# EAGLE design power_bus_v1 (EAGLE 9.6.2)
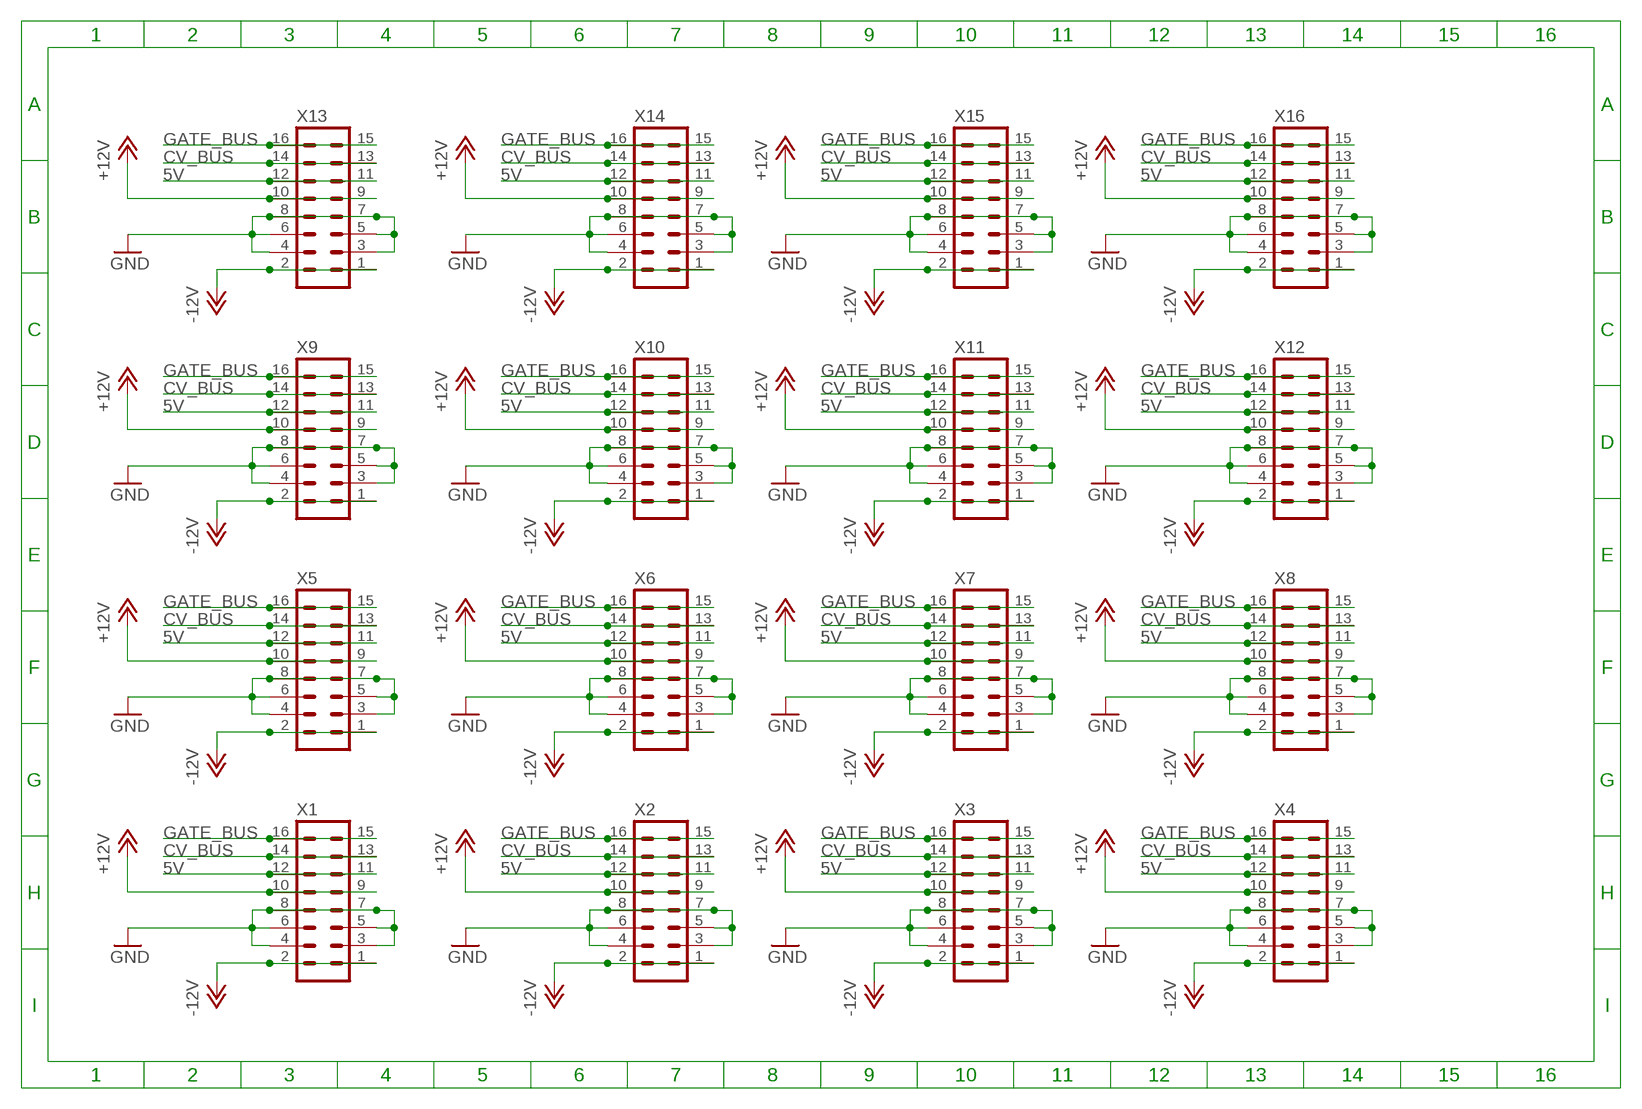
[diagram p0: schematic, sheet 1]

## Parts
X1  ML16  [ML16]
X2  ML16  [ML16]
X3  ML16  [ML16]
X4  ML16  [ML16]
X5  ML16  [ML16]
X6  ML16  [ML16]
X7  ML16  [ML16]
X8  ML16  [ML16]
X9  ML16  [ML16]
X10  ML16  [ML16]
X11  ML16  [ML16]
X12  ML16  [ML16]
X13  ML16  [ML16]
X14  ML16  [ML16]
X15  ML16  [ML16]
X16  ML16  [ML16]

## Nets
5V [power]: X1.11 X1.12 X2.11 X2.12 X3.11 X3.12 X4.11 X4.12 X5.11 X5.12 X6.11 X6.12 X7.11 X7.12 X8.11 X8.12 X9.11 X9.12 X10.11 X10.12 X11.11 X11.12 X12.11 X12.12 X13.11 X13.12 X14.11 X14.12 X15.11 X15.12 X16.11 X16.12
+12V [power]: X1.9 X1.10 X2.9 X2.10 X3.9 X3.10 X4.9 X4.10 X5.9 X5.10 X6.9 X6.10 X7.9 X7.10 X8.9 X8.10 X9.9 X9.10 X10.9 X10.10 X11.9 X11.10 X12.9 X12.10 X13.9 X13.10 X14.9 X14.10 X15.9 X15.10 X16.9 X16.10
-12V [power]: X1.1 X1.2 X2.1 X2.2 X3.1 X3.2 X4.1 X4.2 X5.1 X5.2 X6.1 X6.2 X7.1 X7.2 X8.1 X8.2 X9.1 X9.2 X10.1 X10.2 X11.1 X11.2 X12.1 X12.2 X13.1 X13.2 X14.1 X14.2 X15.1 X15.2 X16.1 X16.2
CV_BUS [power]: X1.13 X1.14 X2.13 X2.14 X3.13 X3.14 X4.13 X4.14 X5.13 X5.14 X6.13 X6.14 X7.13 X7.14 X8.13 X8.14 X9.13 X9.14 X10.13 X10.14 X11.13 X11.14 X12.13 X12.14 X13.13 X13.14 X14.13 X14.14 X15.13 X15.14 X16.13 X16.14
GATE_BUS [power]: X1.15 X1.16 X2.15 X2.16 X3.15 X3.16 X4.15 X4.16 X5.15 X5.16 X6.15 X6.16 X7.15 X7.16 X8.15 X8.16 X9.15 X9.16 X10.15 X10.16 X11.15 X11.16 X12.15 X12.16 X13.15 X13.16 X14.15 X14.16 X15.15 X15.16 X16.15 X16.16
GND [power]: X1.3 X1.4 X1.5 X1.6 X1.7 X1.8 X2.3 X2.4 X2.5 X2.6 X2.7 X2.8 X3.3 X3.4 X3.5 X3.6 X3.7 X3.8 X4.3 X4.4 X4.5 X4.6 X4.7 X4.8 X5.3 X5.4 X5.5 X5.6 X5.7 X5.8 X6.3 X6.4 X6.5 X6.6 X6.7 X6.8 X7.3 X7.4 X7.5 X7.6 X7.7 X7.8 X8.3 X8.4 X8.5 X8.6 X8.7 X8.8 X9.3 X9.4 X9.5 X9.6 X9.7 X9.8 X10.3 X10.4 X10.5 X10.6 X10.7 X10.8 X11.3 X11.4 X11.5 X11.6 X11.7 X11.8 X12.3 X12.4 X12.5 X12.6 X12.7 X12.8 X13.3 X13.4 X13.5 X13.6 X13.7 X13.8 X14.3 X14.4 X14.5 X14.6 X14.7 X14.8 X15.3 X15.4 X15.5 X15.6 X15.7 X15.8 X16.3 X16.4 X16.5 X16.6 X16.7 X16.8

## Library data of the parts
X1-X16 = digital-audio:ML16: MULTICOMP - MC9A12-1634

## Net classes
0 default: width 1.27 mm

## Board
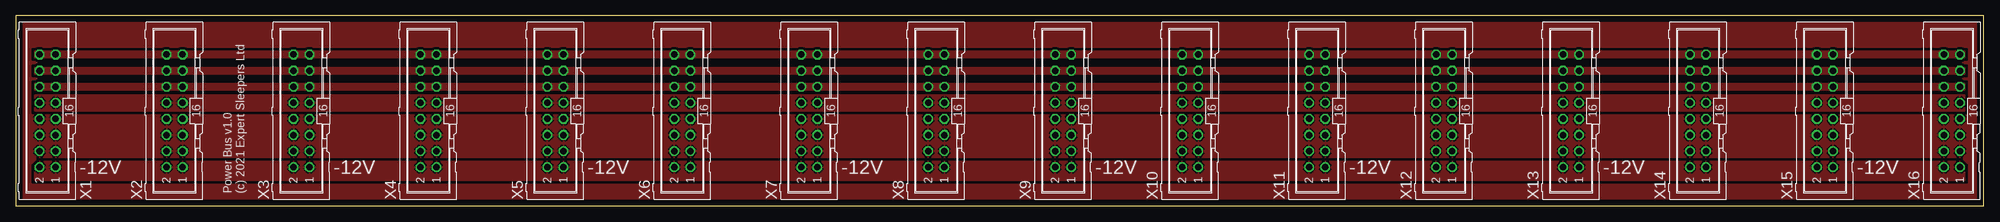
[diagram p1: board, top side]
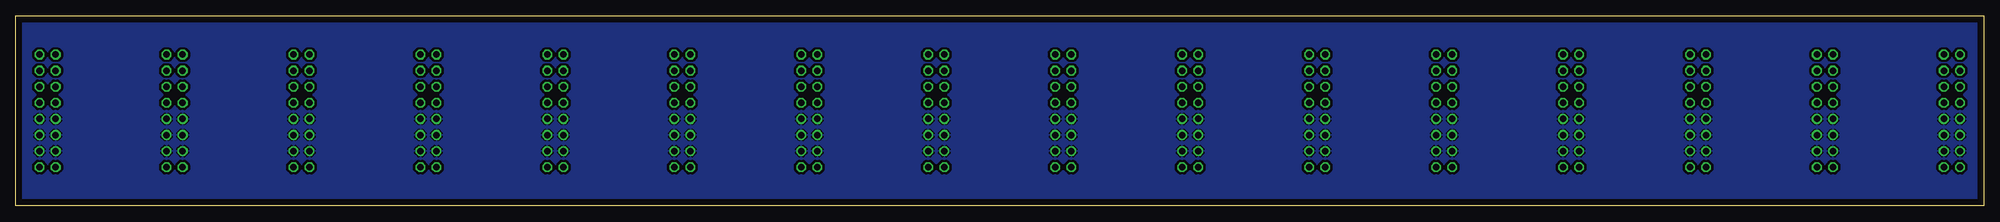
[diagram p2: board, bottom side, seen from below]

Size 310 x 30 mm. Coordinates in mm from the lower left corner, seen from the top.
Outline: 0,0 310,0 310,30 0,30 0,0
Copper layers (1*16): Top 0.035mm / dielectric 1.5mm / Bottom 0.035mm
Design rules "default": minimum track width 6mil, minimum drill 0.35mm, track to track 6mil, track to pad 6mil, pad to pad 6mil, via to via 6mil, smd to smd 6mil, copper to edge 40mil, drill to drill 6mil, minimum pad ring 10mil, minimum via ring 8mil, stop-mask expansion 4mil, vias tented up to drill 0mil, thermal gap 10mil

### Footprints (pad centres in the part's own frame; a part is rotated, then mirrored left to right if it is on the bottom)
ML16 = drill 1.016 octagon: 1 -8.89,-1.27; 2 -8.89,1.27; 3 -6.35,-1.27; 4 -6.35,1.27; 5 -3.81,-1.27; 6 -3.81,1.27; 7 -1.27,-1.27; 8 -1.27,1.27; 9 1.27,-1.27; 10 1.27,1.27; 11 3.81,-1.27; 12 3.81,1.27; 13 6.35,-1.27; 14 6.35,1.27; 15 8.89,-1.27; 16 8.89,1.27

### Placement (x,y rotation side)
X1  5,15 90 top
X2  25,15 90 top
X3  45,15 90 top
X4  65,15 90 top
X5  85,15 90 top
X6  105,15 90 top
X7  125,15 90 top
X8  145,15 90 top
X9  165,15 90 top
X10  185,15 90 top
X11  205,15 90 top
X12  225,15 90 top
X13  245,15 90 top
X14  265,15 90 top
X15  285,15 90 top
X16  305,15 90 top

### Tracks (layer width: path | path; a pad name or v marks a point on that pad's centre or on a via)
5V
  pour Top (no thermals): 3,19.32 307,19.32 307,18.3 3,18.3
+12V
  pour Top: 3,17.5 307,17.5 307,15 3,15
-12V
  pour Top: 3,7 307,7 307,4 3,4
CV_BUS
  pour Top (no thermals): 3,21.86 307,21.86 307,20.84 3,20.84
GATE_BUS
  pour Top (no thermals): 3,24.4 307,24.4 307,23.38 3,23.38
GND
  pour Top (isolate 0.406, rank 2): 0,0 310,0 310,30 0,30
  pour Bottom (isolate 0.406, rank 2): 0,0 310,0 310,30 0,30

### Text on the board
tPlace: -12V | -12V | -12V | -12V | -12V | -12V | -12V | -12V | Power Bus v1.0 | (c) 2021 Expert Sleepers Ltd